# EAGLE design CENTRALE02c3 (EAGLE 9.1.2)
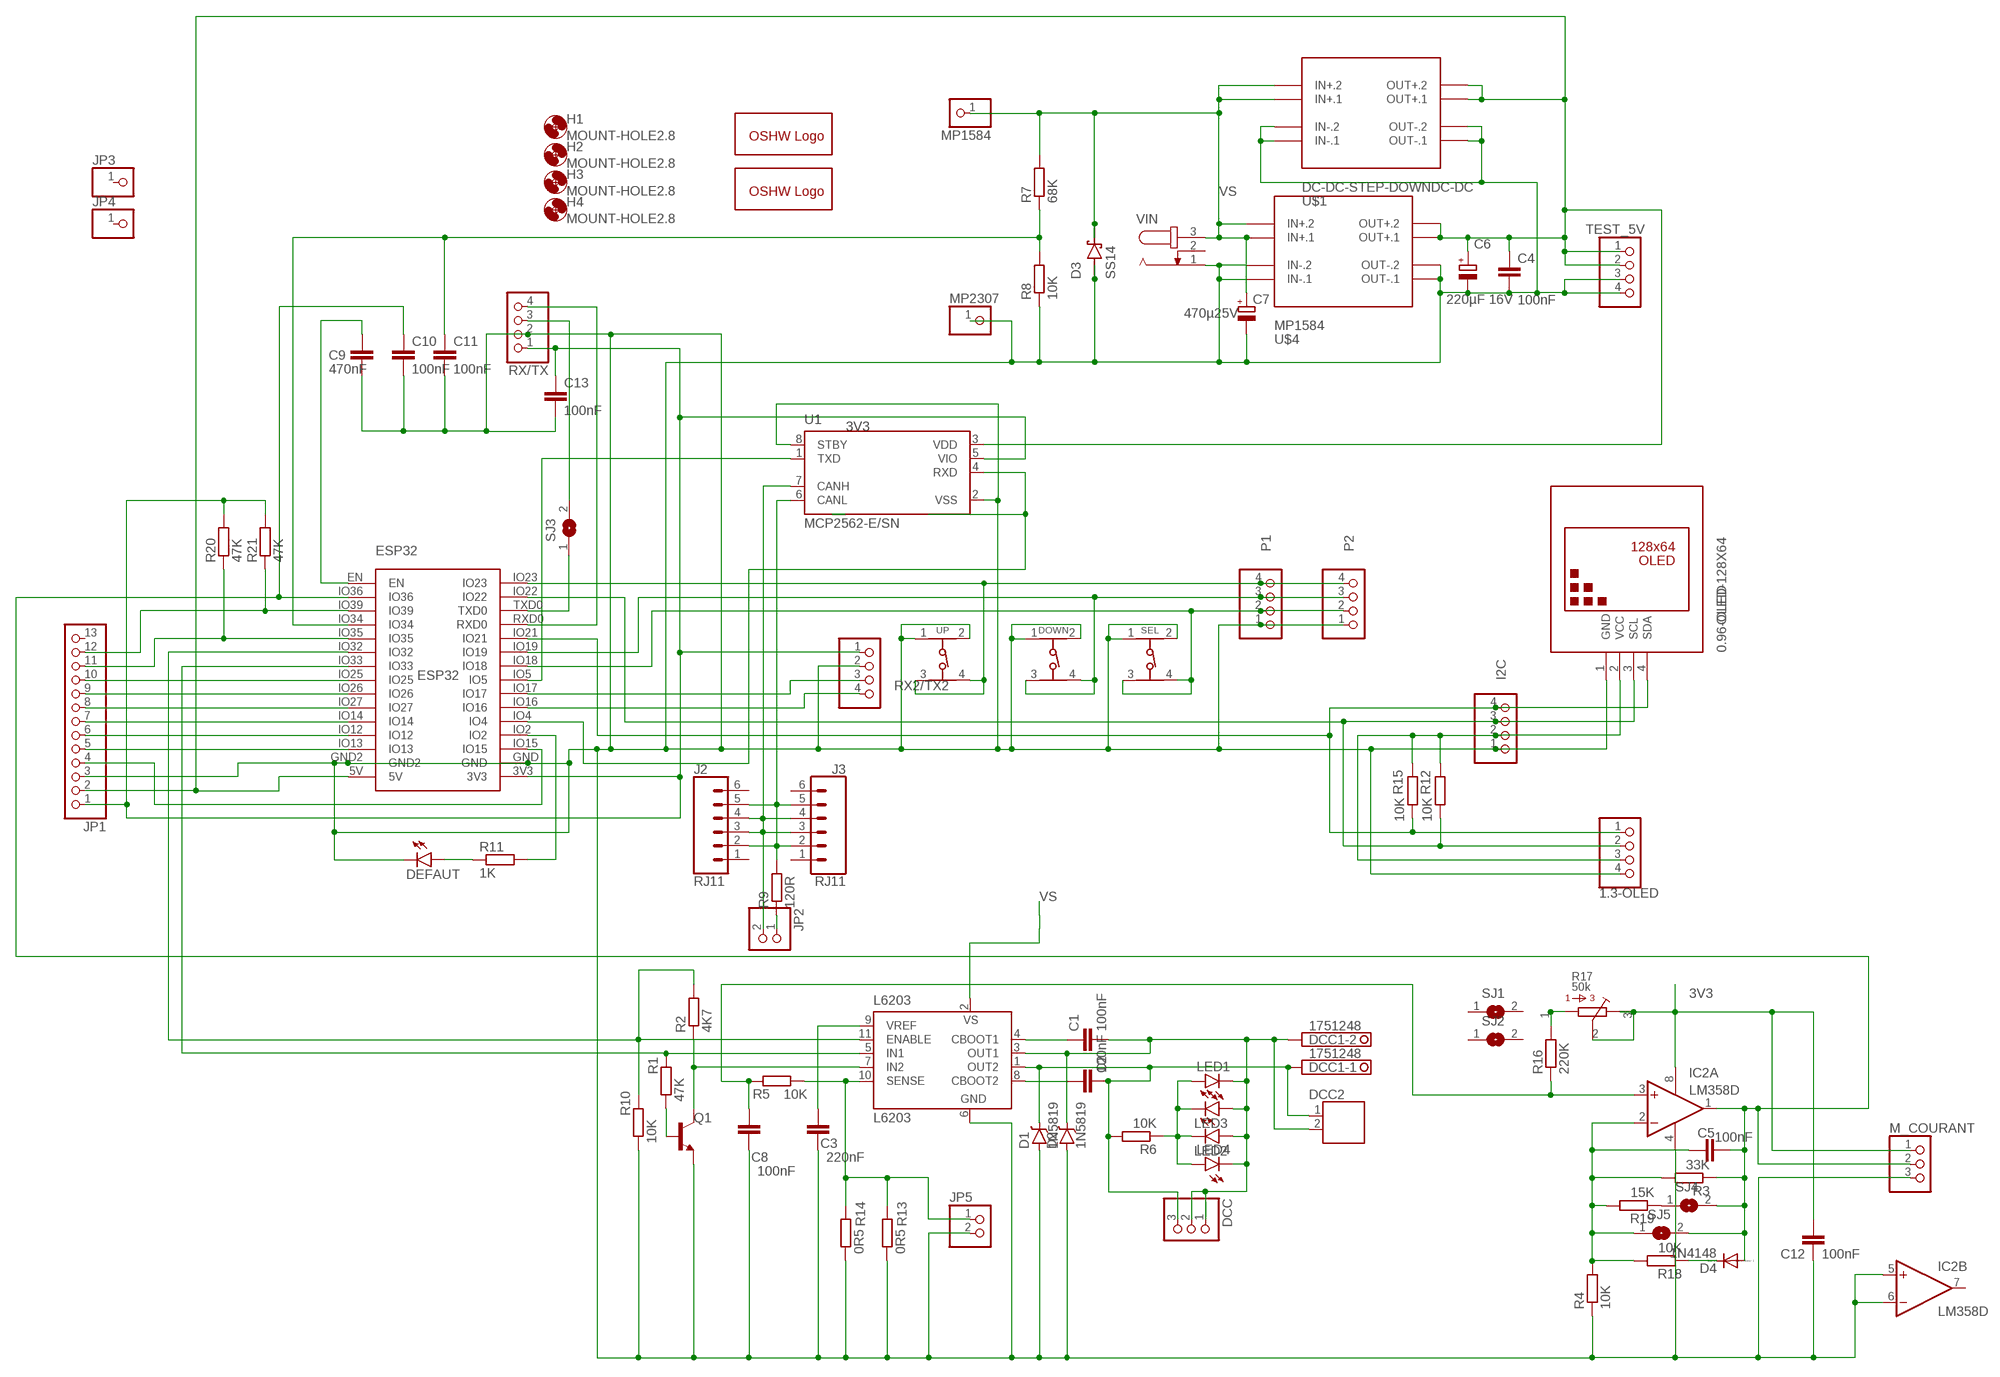
[diagram p0: schematic, sheet 1]

## Parts
0.96-OLED  OLED-128X64  DISPLAY-OLED-128X64-I2C  [DISPLAY-OLED-128X64-I2C]
1.3-OLED  PINHD-1X4  [1X04]
C1  100nF  C-EUC1206  [C1206]
C2  100nF  C-EUC1206  [C1206]
C3  220nF  C-EUC1206  [C1206]
C4  100nF  C-EUC1206  [C1206]
C5  100nF  C-EUC1206  [C1206]
C6  220µF 16V  CPOL-EUE2.5-7  [E2,5-7]
C7  470µ25V  CPOL-EUE5-10.5  [E5-10,5]
C8  100nF  C-EUC1206  [C1206]
C9  470nF  C-EUC1206  [C1206]
C10  100nF  C-EUC1206  [C1206]
C11  100nF  C-EUC1206  [C1206]
C12  100nF  C-EUC1206  [C1206]
C13  100nF  C-EUC1206  [C1206]
D1  1N5819  MBRA140  [SMA-DIODE]
D2  1N5819  MBRA140  [SMA-DIODE]
D3  SS14  [DIOM4325X250N]
D4  1N4148  1N4148DO35-7  [DO35-7]
DCC  PINHD-1X3  [1X03]
DCC1  1751248  [1751248]
DCC2  691502710002  [691502710002]
DEFAUT  LEDSMT1206  [1206]
DOWN  430456073736  [4304X60737X6]
ESP32  ESP32  [ESP32]
GOLD_ORB_SM1  OSHWLOGOLOGO5MM  [OSHW_5MM]
GOLD_ORB_SM2  OSHWLOGOLOGO5MM  [OSHW_5MM]
H1  MOUNT-HOLE2.8  [2,8]
H2  MOUNT-HOLE2.8  [2,8]
H3  MOUNT-HOLE2.8  [2,8]
H4  MOUNT-HOLE2.8  [2,8]
I2C  PINHD-1X4  [1X04]
IC2  LM358D  [SO08]
J2  RJ11  RJ11-6  [RJ11-6]
J3  RJ11  RJ11-6  [RJ11-6]
JP1  PINHD-1X13  [1X13]
JP2  PINHD-1X2  [1X02]
JP3  PINHD-1X1  [1X01]
JP4  PINHD-1X1  [1X01]
JP5  PINHD-1X2  [1X02]
L6203  L6203  [MULTIWATT-11]
LED1  LEDSMT1206  [1206]
LED2  LED3MM  [LED3MM]
LED3  LEDSMT1206  [1206]
LED4  LED3MM  [LED3MM]
M_COURANT  PINHD-1X3  [1X03]
MP1584  PINHD-1X1  [1X01]
MP2307  PINHD-1X1  [1X01]
P1  PINHD-1X4  [1X04]
P2  PINHD-1X4  [1X04]
Q1  MMBT3904LT1-NPN-SOT23-BEC  [SOT23-BEC]
R1  47K  R-EU_R0805  [R0805]
R2  4K7  R-EU_R0805  [R0805]
R3  33K  R-EU_R0805  [R0805]
R4  10K  R-EU_R0805  [R0805]
R5  10K  R-EU_R0805  [R0805]
R6  10K  R-EU_R0805  [R0805]
R7  68K  R-EU_R0805  [R0805]
R8  10K  R-EU_R0805  [R0805]
R9  120R  R-EU_M1206  [M1206]
R10  10K  R-EU_R0805  [R0805]
R11  1K  R-EU_R0805  [R0805]
R12  10K  R-EU_R0805  [R0805]
R13  0R5  R-EU_R2512  [R2512]
R14  0R5  R-EU_R2512  [R2512]
R15  10K  R-EU_R0805  [R0805]
R16  220K  R-EU_R0805  [R0805]
R17  50k  3386  [3386-MULTI]
R18  10K  R-EU_R0805  [R0805]
R19  15K  R-EU_R0805  [R0805]
R20  47K  R-EU_R0805  [R0805]
R21  47K  R-EU_R0805  [R0805]
RX2/TX2  PINHD-1X4  [1X04]
RX/TX  PINHD-1X4  [1X04]
SEL  430456073736  [4304X60737X6]
SJ1  SJ  [SJ]
SJ2  SJ  [SJ]
SJ3  SJ  [SJ]
SJ4  SJ  [SJ]
SJ5  SJ  [SJ]
TEST_5V  PINHD-1X4  [1X04]
U1  MCP2562-E/SN  [SOIC127P600X175-8N]
U$1  DC-DC-STEP-DOWNDC-DC  [DC-DC-STEP-DOWN]
U$4  MP1584  DC-DC-STEP-DOWN-MP1584  [DC-DC-STEP-DOWN-MP1584]
UP  430456073736  [4304X60737X6]
VIN  JACK-PLUG0  [SPC4077]

## Nets
3V3: 0.96-OLED.2(VCC) 1.3-OLED.3 C12.2 C13.2 ESP32.3V3 I2C.2 IC2.8(P:V+) JP1.1 M_COURANT.1 R12.1 R15.1 R17.2 R17.3 R17.6 R20.2 R21.2 RX2/TX2.1 RX/TX.1 U1.5(VIO)
GND [GND]: 0.96-OLED.1(GND) 1.3-OLED.4 C3.1 C4.2 C6.- C7.- C8.1 C9.2 C10.1 C11.1 C12.1 C13.1 D1.A D2.A D3.A DEFAUT.C DOWN.1 DOWN.2 ESP32.GND ESP32.GND2 I2C.1 IC2.4(P:V-) IC2.5(B:+IN) IC2.6(B:-IN) JP1.3 JP5.2 L6203.6(GND) M_COURANT.3 MP2307.1 P1.1 P2.1 Q1.E R4.1 R8.1 R10.1 R13.1 R14.1 RX2/TX2.2 RX/TX.2 SEL.1 SEL.2 TEST_5V.3 TEST_5V.4 U1.2(VSS) U1.8(STBY) U$1.IN-.1 U$1.IN-.2 U$1.OUT-.1 U$1.OUT-.2 U$4.IN-.1 U$4.IN-.2 U$4.OUT-.1 U$4.OUT-.2 UP.1 UP.2 VIN.1
N$1: L6203.7(IN2) Q1.C R2.1
N$2: C1.1 L6203.4(CBOOT1)
N$3: C2.1 L6203.8(CBOOT2)
N$4: ESP32.IO15 JP1.4
N$5 [PWR]: C2.2 D1.C DCC1.1 DCC2.1 DCC.3 L6203.1(OUT2) R6.2
N$6 [PWR]: C1.2 D2.C DCC1.2 DCC2.2 DCC.1 DCC.2 L6203.3(OUT1) LED1.C LED2.A LED3.A LED4.K(C)
N$7: Q1.B R1.1
N$8: C5.1 IC2.2(A:-IN) R3.2 R4.2 R18.2 R19.2 SJ5.1
N$9: C3.2 L6203.9(VREF)
N$10: C5.2 C10.2 D4.A ESP32.IO36 IC2.1(A:OUT) M_COURANT.2 R3.1 SJ4.2 SJ5.2
N$11 [PWR]: JP5.1 L6203.10(SENSE) R5.1 R13.2 R14.2
N$12: RX/TX.3 SJ3.2
N$13: C11.2 ESP32.IO34 R7.1 R8.2
N$14: C4.1 C6.+ ESP32.5V JP1.2 TEST_5V.1 TEST_5V.2 U1.3(VDD) U$1.OUT+.1 U$1.OUT+.2 U$4.OUT+.1 U$4.OUT+.2
N$15: C8.2 IC2.3(A:+IN) R5.2 R16.1
N$16: J2.3 J2.4 J3.3 J3.4 JP2.2 U1.7(CANH)
N$17: ESP32.IO5 U1.1(TXD)
N$18: ESP32.IO32 L6203.11(ENABLE) R2.2 R10.2
N$19: DEFAUT.A R11.1
N$20: ESP32.IO13 JP1.5
N$21: ESP32.IO4 U1.4(RXD)
N$22: JP2.1 R9.1
N$23: ESP32.IO12 JP1.6
N$24: ESP32.IO23 P1.4 P2.4 UP.3 UP.4
N$25: ESP32.IO14 JP1.7
N$26: ESP32.IO27 JP1.8
N$27: ESP32.IO18 P1.2 P2.2 SEL.3 SEL.4
N$28: ESP32.IO26 JP1.9
N$29: ESP32.IO35 JP1.11 R20.1
N$30: ESP32.IO39 JP1.12 R21.1
N$31: 0.96-OLED.4(SDA) 1.3-OLED.1 ESP32.IO21 I2C.4 R15.2
N$32: ESP32.IO25 JP1.10
N$33: 0.96-OLED.3(SCL) 1.3-OLED.2 ESP32.IO22 I2C.3 R12.2
N$34: ESP32.IO33 L6203.5(IN1) R1.2
N$35: R16.2 R17.1 R17.4
N$36: ESP32.IO17 RX2/TX2.3
N$37: D4.C R18.1
N$38: LED1.A LED2.K(C) LED3.C LED4.A R6.1
N$39: R19.1 SJ4.1
N$41: DOWN.3 DOWN.4 ESP32.IO19 P1.3 P2.3
N$42: J2.2 J2.5 J3.2 J3.5 R9.2 U1.6(CANL)
N$45: ESP32.RXD0 RX/TX.4
N$46: ESP32.TXD0 SJ3.1
N$48: ESP32.IO2 R11.2
N$49: C9.1 ESP32.EN
N$52: ESP32.IO16 RX2/TX2.4
VS [VS]: C7.+ D3.C(K) L6203.2(VS) MP1584.1 R7.2 U$1.IN+.1 U$1.IN+.2 U$4.IN+.1 U$4.IN+.2 VIN.3
Unconnected: IC2.7(B:OUT) J2.1 J2.6 J3.1 J3.6 JP1.13 JP3.1 JP4.1 R17.5 SJ1.1 SJ1.2 SJ2.1 SJ2.2 VIN.2

## Library data of the parts
0.96-OLED = nano3:DISPLAY-OLED-128X64-I2C: 128x64 Dot Matrix OLED Module based on SSD1306 chip Variant with I2C interface More details available here: http://www.instructables.com/id/Monochrome-096-i2c-OLED-display-with-arduino-SSD13/ SSD1306 datasheet: https://cdn-shop.adafruit.com/datasheets/SSD1306.pdf Click here to find device on ebay.com <http://www.ebay.com/sch/oled+display+128x64+iic> Note: There are two variants: I2C and SPI. Search for the proper version.
1.3-OLED I2C P1 P2 RX2/TX2 RX/TX TEST_5V = pinhead:PINHD-1X4: PIN HEADER
C1-C5 C8-C13 = rcl:C-EU: CAPACITOR, European symbol; SPICEPREFIX: C
C6 C7 = rcl:CPOL-EU: POLARIZED CAPACITOR, European symbol; SPICEPREFIX: C
D1 D2 = MBRA140:MBRA140: 40V, 1A Schottky rectifier SMA/DO-214AC package DIO-08053 Check prices <https://pricing.snapeda.com/parts/MBRA140/ON%20Semiconductor/view-part?ref=eda>; AVAILABILITY: In Stock; DESCRIPTION: Schottky Diodes & Rectifiers REC SMA 1A 40V SHTKY TR; MF: ON Semiconductor; MP: MBRA140; PACKAGE: DO-214 ON Semiconductor; PRICE: None; PURCHASE-URL: https://pricing.snapeda.com/search/part/MBRA140/?ref=eda
D3 = SS14:SS14: Check availability <https://pricing.snapeda.com/parts/SS14/Taiwan%20Semiconductor/view-part?ref=eda>; AVAILABILITY: In Stock; CHECK_PRICES: https://www.snapeda.com/parts/SS14/Taiwan+Semiconductor/view-part/?ref=eda; DESCRIPTION: 1A, 40V, Schottky Rectifier; MF: Taiwan Semiconductor; MP: SS14; PACKAGE: SMA-2 Taiwan Semiconductor; PRICE: None; SNAPEDA_LINK: https://www.snapeda.com/parts/SS14/Taiwan+Semiconductor/view-part/?ref=snap
D4 = diode:1N4148: DIODE high speed (Philips)
DCC M_COURANT = pinhead:PINHD-1X3: PIN HEADER
DCC1 = con-phoenix-350:1751248: MKDS 1/ 2-3,5 Printklemme Nennstrom: 10 A Bemessungsspannung: 160 V Raster: 3,5 mm Polzahl: 2 Montageart: Löten Anschlussart: Schraubanschluss Anschlussrichtung vom Leiter zur Platine: 0° Source: http://eshop.phoenixcontact.com .. 1751248.pdf; OC_FARNELL: unknown; OC_NEWARK: unknown
DCC2 = Wurth_Elektronik_Electromechanic_Terminal_Blocks_Connectors_rev16b:691502710002: WR-TBL Terminal block - serie 5027 - 2 Pins;=>Code : Con_TBL_Screw_PressureClamp_6915027100xx_691502710002 <http://katalog.we-online.de/media/images/eican/Con_TBL_Screw_PressureClamp_6915027100xx_pf2.jpg> Details see: http://katalog.we-online.de/em/datasheet/6915027100xx.pdf Created 11/27/2014, Karrer Zheng 2014 (C) Wurth Elektronik
DEFAUT LED1-LED4 = led:LED: LED OSRAM: - CHIPLED LG R971, LG N971, LY N971, LG Q971, LY Q971, LO R971, LY R971 LH N974, LH R974 LS Q976, LO Q976, LY Q976 LO Q996 - Hyper CHIPLED LW Q18S LB Q993, LB Q99A, LB R99A - SideLED LS A670, LO A670, LY A670, LG A670, LP A670 LB A673, LV A673, LT A673, LW A673 LH A674 LY A675 LS A676, LA A676, LO A676, LY A676, LW A676 LS A679, LY A679, LG A679 - Hyper Micro SIDELED® LS Y876, LA Y876, LO Y876, LY Y876 LT Y87S - SmartLED LW L88C, LW L88S LB L89C, LB L89S, LG L890 LS L89K, LO L89K, LY L89K LS L896, LA L896, LO L896, LY L896 - TOPLED LS T670, LO T670, LY T670, LG T670, LP T670 LSG T670, LSP T670, LSY T670, LOP T670, LYG T670 LG T671, LOG T671, LSG T671 LB T673, LV T673, LT T673, LW T673 LH T674 LS T676, LA T676, LO T676, LY T676, LB T676, LH T676, LSB T676, LW T676 LB T67C, LV T67C, LT T67C, LS T67K, LO T67K, LY T67K, LW E67C LS E67B, LA E67B, LO E67B, LY E67B, LB E67C, LV E67C, LT E67C LW T67C LS T679, LY T679, LG T679 LS T770, LO T770, LY T770, LG T770, LP T770 LB T773, LV T773, LT T773, LW T773 LH T774 LS E675, LA E675, LY E675, LS T675 LS T776, LA T776, LO T776, LY T776, LB T776 LHGB T686 LT T68C, LB T68C - Hyper Mini TOPLED® LB M676 - Mini TOPLED Santana® LG M470 LS M47K, LO M47K, LY M47K Source: http://www.osram.convergy.de LUXEON: - LUMILED® LXK2-PW12-R00, LXK2-PW12-S00, LXK2-PW14-U00, LXK2-PW14-V00 LXK2-PM12-R00, LXK2-PM12-S00, LXK2-PM14-U00 LXK2-PE12-Q00, LXK2-PE12-R00, LXK2-PE12-S00, LXK2-PE14-T00, LXK2-PE14-U00 LXK2-PB12-K00, LXK2-PB12-L00, LXK2-PB12-M00, LXK2-PB14-N00, LXK2-PB14-P00, LXK2-PB14-Q00 LXK2-PR12-L00, LXK2-PR12-M00, LXK2-PR14-Q00, LXK2-PR14-R00 LXK2-PD12-Q00, LXK2-PD12-R00, LXK2-PD12-S00 LXK2-PH12-R00, LXK2-PH12-S00 LXK2-PL12-P00, LXK2-PL12-Q00, LXK2-PL12-R00 Source: www.luxeon.com KINGBRIGHT: KA-3528ASYC Source: www.kingbright.com
DOWN SEL UP = o163724v244 Eagle_WS-TATV (rev20a):430456073736: WS-TATV THT Washable Tact Switch 12x12 mm Material Properties Cover Material : Stainless Steel Properties Actuator Material:LCP Actuator Flammability Rating:UL94 V-0 Actuator Color:Black; Salmon; White Frame Material:PPA Frame Flammability Rating:UL94 HB Frame Color:Black Contact Material:Stainless Steel Contact Plating:Silver Terminal Material:Copper Alloy Terminal Plating:Silver VR:12 V (DC) Contact Resistance Initial:100 mΩ Contact Resistance After Life Test:2 Ω RISO:100 MΩ Withstanding Voltage:250 V (AC) Washable:Yes Qty.:50 Mechanical Properties Electrical Life:200000 Times; 300000 Times; 500000 Times Stroke :0.3 mm General Information Operating Temperature:-40 up to +85 °C Washable:Yes <https://www.we-online.com/catalog/media/o61120v209%20Family_WS_TSW_THT_4304x60xx7x6_pf2.jpg> Details see: https://www.we-online.com/catalog/en/TATV_12X12_THT_WASHABLE_4304x60xx7x6/ Updated by yingchun,Shan;2020-02-21 2020(C) Würth Elektronik; DATASHEET-URL: https://www.we-online.com/catalog/datasheet/430456073736.pdf; H: 7.3mm; OPERATION-FORCE: 360g; PART-NUMBER: 430456073736; QTY: 50
ESP32 = ESP32-DEVKIT_M2:ESP32: Quadruple half-H driver; AVAILABILITY: Unavailable; DESCRIPTION: Half Bridge _4_ Driver DC Motors, General Purpose, Solenoids, Stepper Motors Bipolar 16-PDIP; MF: Texas Instruments; MP: SN754410; PACKAGE: PDIP-16 Texas Instruments; PRICE: None
GOLD_ORB_SM1 GOLD_ORB_SM2 = oshw:OSHWLOGO: The OSHW logo for PCB layout
H1-H4 = holes:MOUNT-HOLE: MOUNTING HOLE with drill center marker
IC2 = linear:LM358: OP AMP also LM158; LM258; LM2904 Source: http://cache.national.com/ds/LM/LM158.pdf
J2 J3 = SparkFun-Connectors:RJ11-6: RJ11 Jack - 6 pin Commonly found on CAT3 devices and some Microchip programmers. Here is the connector we sell at SparkFun: RJ11 6-Pin Connector <https://www.sparkfun.com/products/132> (PRT-00132) Datasheet <http://www.sparkfun.com/datasheets/Prototyping/Connectors/RJ11-Datasheet.pdf> It is used on this SparkFun product: SparkFun Weather Shield <https://www.sparkfun.com/products/12081> (DEV-12081) Weather Meters <https://www.sparkfun.com/products/8942> (SEN-08942); PROD_ID: CONN-08590; SF_ID: PRT-00132
JP1 = pinhead:PINHD-1X13: PIN HEADER
JP2 JP5 = pinhead:PINHD-1X2: PIN HEADER
JP3 JP4 = adafruit:PINHD-1X1: Pin header 1x1 for 0.1" spacing With round pins
L6203 = st-microelectronics:L6203: DMOS FULL BRIDGE DRIVER; MPN: L6203; OC_FARNELL: 1467715; OC_NEWARK: 56P8434
MP1584 MP2307 = pinhead:PINHD-1X1: PIN HEADER
Q1 = transistor:*-NPN-: NPN Transistror BF959 corrected 2008.03.06
R1-R8 R10-R16 R18-R21 = rcl:R-EU_: RESISTOR, European symbol; SPICEPREFIX: R
R9 = resistor:R-EU_: RESISTOR, European symbol
R17 = 3386M3:3386: 3386 Series 3/8" Square Trimmer (Multi-Package F,P,K & Y)
SJ1-SJ5 = jumper:SJ: SMD solder JUMPER
U1 = MCP2562-E_SN:MCP2562-E/SN: MCP2562 Series 5 V Surface Mount High-Speed CAN Transceiver - SOIC-8 Check availability <https://pricing.snapeda.com/parts/MCP2562-E/SN/Microchip/view-part?ref=eda>; AVAILABILITY: In Stock; CHECK_PRICES: https://www.snapeda.com/parts/MCP2562-E/SN/Microchip/view-part/?ref=eda; DESCRIPTION: Microchip MCP2562-E/SN,CAN Transceiver 1MBps 1-channel IEC 61000-4-2,8-Pin SOIC | Microchip Technology Inc. MCP2562-E/SN; MF: Microchip; MP: MCP2562-E/SN; PACKAGE: SO-8 Microchip; PRICE: None; PURCHASE-URL: https://www.snapeda.com/api/url_track_click_mouser/?unipart_id=234490&manufacturer=Microchip&part_name=MCP2562-E/SN&search_term=None; SNAPEDA_LINK: https://www.snapeda.com/parts/MCP2562-E/SN/Microchip/view-part/?ref=snap
U$1 = dc-dc:DC-DC-STEP-DOWN: DC/DC Step-Down Regulator
U$4 = diy-modules:DC-DC-STEP-DOWN-MP1584: DC/DC Step-Down Regulator based on MP1584 chip MP1584 datasheet available here: http://www.haoyuelectronics.com/Attachment/MP1584/MP1584.pdf Click here to find device on ebay.com <http://www.ebay.com/sch/mp1584+module>
VIN = con-jack:JACK-PLUG: DC POWER JACK Power Jack, DC, Right Angle, Through Hole, Rated 5A at 16VDC, PC Terminals Distributor: Farnell (www.Farnell.de) Drawing: 84N1161.pdf / 84N1162.pdf Manufacturer: SPC Technology (www.spctechnology.com) Type: SPC4077 / SPC 4078

## Net classes
0 default: width 0.305 mm
1 PWR: width 1.372 mm
2 VS: width 1.372 mm
3 GND: width 0.914 mm

## Board
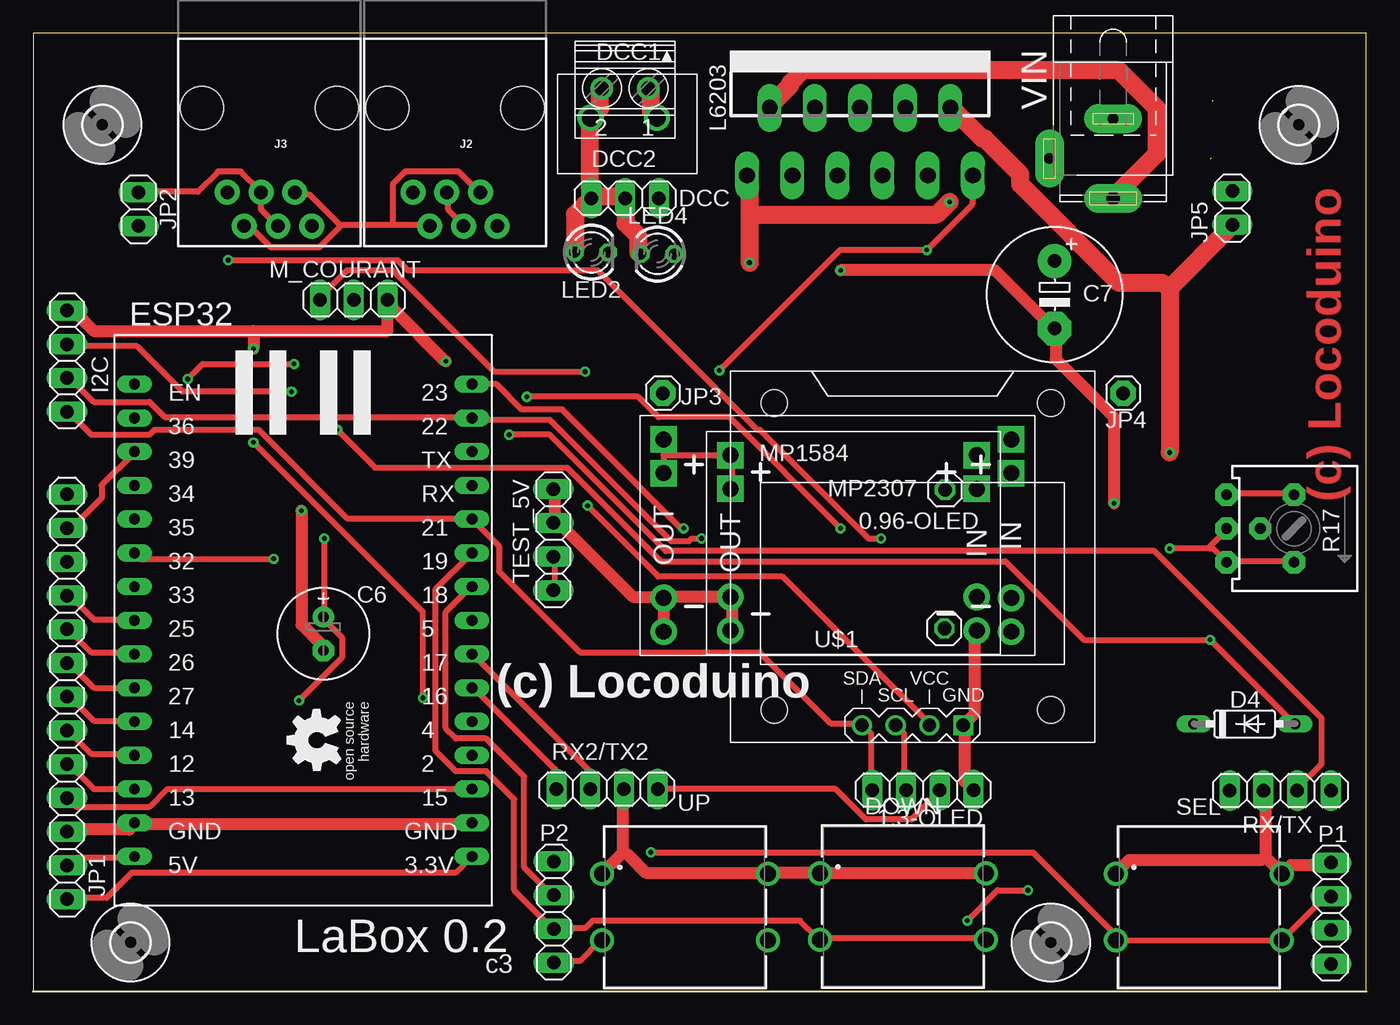
[diagram p1: board, top side]
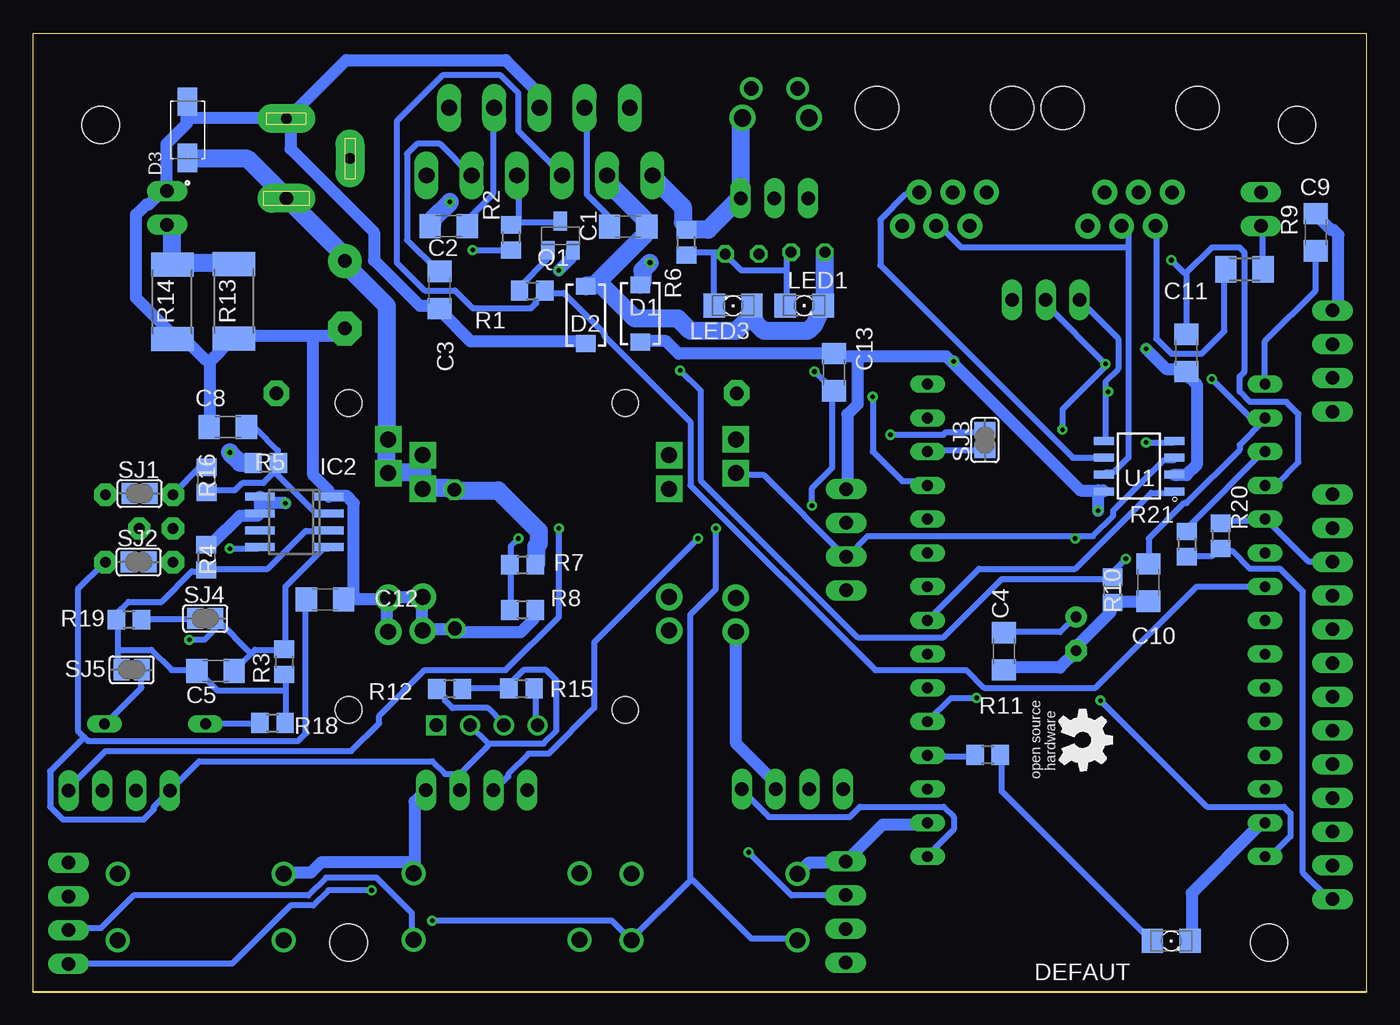
[diagram p2: board, bottom side, seen from below]

Size 100.33 x 72.14 mm. Coordinates in mm from the lower left corner, seen from the top.
Outline: 100.33,0 100.33,72.14 0,72.12 0,0 100.33,0
Copper layers (1*16): Top 0.035mm / dielectric 1.5mm / Bottom 0.035mm
Design rules "default *": minimum track width 18mil, minimum drill 0.35mm, track to track 12mil, track to pad 12mil, pad to pad 12mil, via to via 12mil, smd to smd 12mil, copper to edge 40mil, drill to drill 12mil, minimum pad ring 10mil, minimum via ring 8mil, stop-mask expansion 4mil, vias tented up to drill 0mil, thermal gap 10mil

### Footprints (pad centres in the part's own frame; a part is rotated, then mirrored left to right if it is on the bottom)
DISPLAY-OLED-128X64-I2C = drill 1 square: 1 -3.81,12.7 | drill 1: 2 -1.27,12.7; 3 1.27,12.7; 4 3.81,12.7 | hole 2: -10.414,11.557; 10.414,11.557; 10.414,-11.557; -10.414,-11.557
1X04 = drill 1.016 long: 1 -3.81,0; 2 -1.27,0; 3 1.27,0; 4 3.81,0
C1206 = smd 1.6 x 1.8: 1 -1.4,0; 2 1.4,0
E2,5-7 = drill 0.813 pad 1.6: + -1.27,0 | drill 0.813 pad 1.6 octagon: - 1.27,0
E5-10,5 = drill 1.016 pad 2.54: + -2.54,0 | drill 1.016 pad 2.54 octagon: - 2.54,0
SMA-DIODE = smd 1.27 x 1.47: A -2.15,0; C 2.15,0
DIOM4325X250N = smd 2.12 x 1.5: A 2.115,0; C -2.115,0
DO35-7 = drill 0.813 long: A 3.81,0; C -3.81,0
1X03 = drill 1.016 long: 1 -2.54,0; 2 0,0; 3 2.54,0
1751248 = drill 1.1 pad 1.7: 1 -1.75,-0.1; 2 1.75,-0.1
691502710002 = drill 1.3: 1 -2.5,0; 2 2.5,0
1206 = smd 1.6 x 1.803: A -1.422,0; C 1.422,0
4304X60737X6 = drill 1.2: 1 -6.25,2.5; 2 6.25,2.5; 3 -6.25,-2.5; 4 6.25,-2.5
ESP32 = drill 0.813 long: 3V3 29.21,10.16; 5V 3.81,10.16; EN 3.81,45.72; GND 29.21,12.7; GND2 3.81,12.7; IO2 29.21,17.78; IO4 29.21,20.32; IO5 29.21,27.94; IO12 3.81,17.78; IO13 3.81,15.24; IO14 3.81,20.32; IO15 29.21,15.24; IO16 29.21,22.86; IO17 29.21,25.4; IO18 29.21,30.48; IO19 29.21,33.02; IO21 29.21,35.56; IO22 29.21,43.18; IO23 29.21,45.72; IO25 3.81,27.94; IO26 3.81,25.4; IO27 3.81,22.86; IO32 3.81,33.02; IO33 3.81,30.48; IO34 3.81,38.1; IO35 3.81,35.56; IO36 3.81,43.18; IO39 3.81,40.64; RXD0 29.21,38.1; TXD0 29.21,40.64
2,8 = hole 2.8: 0,0
SO08 = smd 0.6 x 2.2: 1 -1.905,-2.6; 2 -0.635,-2.6; 3 0.635,-2.6; 4 1.905,-2.6; 5 1.905,2.6; 6 0.635,2.6; 7 -0.635,2.6; 8 -1.905,2.6
RJ11-6 = drill 1.016 pad 1.88: 1 -3.175,8.89; 2 -1.905,6.35; 3 -0.635,8.89; 4 0.635,6.35; 5 1.905,8.89; 6 3.175,6.35 | hole 3.251: -5.08,0; 5.08,0
1X13 = drill 1.016 long: 1 -15.24,0; 2 -12.7,0; 3 -10.16,0; 4 -7.62,0; 5 -5.08,0; 6 -2.54,0; 7 0,0; 8 2.54,0; 9 5.08,0; 10 7.62,0; 11 10.16,0; 12 12.7,0; 13 15.24,0
1X02 = drill 1.016 long: 1 -1.27,0; 2 1.27,0
1X01 = drill 1.016 pad 1.93 octagon: 1 0,0
MULTIWATT-11 = drill 1.2 long: 1 -8.5,-6.35; 2 -6.8,-1.27; 3 -5.1,-6.35; 4 -3.4,-1.27; 5 -1.7,-6.35; 6 0,-1.27; 7 1.7,-6.35; 8 3.4,-1.27; 9 5.1,-6.35; 10 6.8,-1.27; 11 8.5,-6.35
LED3MM = drill 0.813 octagon: A -1.27,0; K 1.27,0
1X01' = drill 1.016 octagon: 1 0,0
SOT23-BEC = smd 1 x 1.4: B -0.95,-1.1; C 0,1.1; E 0.95,-1.1
R0805 = smd 1.3 x 1.5: 1 -0.95,0; 2 0.95,0
M1206 = smd 1.6 x 2: 1 -1.4,0; 2 1.4,0
R2512 = smd 1.8 x 3.2: 1 -2.8,0; 2 2.8,0
3386-MULTI = drill 0.813 pad 1.676 octagon: 1 -2.54,-5.08; 2 0,-5.08; 3 2.54,-5.08; 4 -2.54,0; 5 0,-2.54; 6 2.54,0
SJ = smd 1.168 x 1.6: 1 -0.762,0; 2 0.762,0
SOIC127P600X175-8N = smd 1.5 x 0.6: 1 -2.65,1.905; 2 -2.65,0.635; 3 -2.65,-0.635; 4 -2.65,-1.905; 5 2.65,-1.905; 6 2.65,-0.635; 7 2.65,0.635; 8 2.65,1.905
DC-DC-STEP-DOWN = drill 1.2 pad 2 square: IN+.1 -13.081,-4.699; IN+.2 -13.081,-7.239; OUT+.1 13.081,-4.699; OUT+.2 13.081,-7.239 | drill 1.2 pad 2: IN-.1 -13.081,7.239; IN-.2 -13.081,4.699; OUT-.1 13.081,7.239; OUT-.2 13.081,4.699
DC-DC-STEP-DOWN-MP1584 = drill 1.2 pad 2 square: IN+.1 -9.271,-4.064; IN+.2 -9.271,-6.604; OUT+.1 9.271,-4.064; OUT+.2 9.271,-6.604 | drill 1.2 pad 2: IN-.1 -9.271,6.604; IN-.2 -9.271,4.064; OUT-.1 9.271,6.604; OUT-.2 9.271,4.064
SPC4077 = drill 0.8 pad 2.184 long: 1 -3,0; 2 0,-4.8 | drill 1 pad 2.184 long: 3 3,0

### Placement (x,y rotation side)
0.96-OLED  66.18,32.74 180 top
1.3-OLED  66.97,15.16 0 top
C1  55.55,57.57 0 bottom
C2  69.06,57.62 180 bottom
C3  69.73,52.8 90 bottom
C4  27.27,25.61 270 bottom
C5  86.6,24.14 0 bottom
C6  21.83,26.93 270 top
C7  76.88,52.45 270 top
C8  85.68,42.49 0 bottom
C9  3.81,57.15 90 bottom
C10  16.41,30.79 90 bottom
C11  13.54,48.07 90 bottom
C12  78.36,29.51 180 bottom
C13  40.05,46.62 270 bottom
D1  54.64,51.04 90 bottom
D2  58.73,50.93 90 bottom
D3  88.72,64.87 90 bottom
D4  91.16,20.16 0 top
DCC  44.55,59.71 0 top
DCC1  44.55,67.89 180 top
DCC2  44.45,65.76 180 top
DEFAUT  14.68,3.81 0 bottom
DOWN  65.47,6.39 0 top
ESP32  3.81,0 0 top
GOLD_ORB_SM1  21.35,18.93 90 top
GOLD_ORB_SM2  21.35,18.94 270 bottom
H1  76.59,3.69 0 top
H2  95.25,65.24 0 top
H3  5.2,65.24 0 top
H4  7.33,3.7 0 top
I2C  2.54,47.46 270 top
IC2  80.68,35.35 90 bottom
J2  31.75,66.51 180 top
J3  17.78,66.51 180 top
JP1  2.54,22.19 90 top
JP2  7.94,58.89 90 top
JP3  47.38,45.05 0 top
JP4  82.04,45.04 0 top
JP5  90.25,58.99 90 top
L6203  62.23,67.78 0 top
LED1  42.3,51.63 0 bottom
LED2  42.02,55.65 0 top
LED3  47.65,51.62 180 bottom
LED4  46.98,55.52 180 top
M_COURANT  24.13,52.07 0 top
MP1584  [1X01']  68.63,37.78 180 top
MP2307  [1X01']  68.58,27.33 180 top
P1  97.67,5.89 270 top
P2  39.18,5.98 270 top
Q1  60.65,56.89 0 bottom
R1  62.78,52.75 0 bottom
R2  64.36,56.76 270 bottom
R3  81.44,24.82 270 bottom
R4  87.3,32.68 270 bottom
R5  82.83,39.77 0 bottom
R6  51.17,56.39 90 bottom
R7  63.5,32.13 0 bottom
R8  63.5,28.74 180 bottom
R9  9.16,54.37 180 bottom
R10  19.09,30.23 90 bottom
R11  28.5,17.81 180 bottom
R12  68.99,22.78 180 bottom
R13  85.22,51.96 90 bottom
R14  89.86,51.9 90 bottom
R15  63.59,22.81 0 bottom
R16  87.28,38.51 90 bottom
R17  94.9,34.85 270 top
R18  82.31,20.22 0 bottom
R19  93.12,27.99 180 bottom
R20  10.97,34.29 270 bottom
R21  13.51,33.67 270 bottom
RX2/TX2  43.18,15.24 180 top
RX/TX  93.86,15.12 0 top
SEL  87.74,6.35 0 top
SJ1  92.32,37.49 0 bottom
SJ2  92.39,32.33 0 bottom
SJ3  28.7,41.51 90 bottom
SJ4  87.38,28.08 0 bottom
SJ5  92.92,24.23 0 bottom
TEST_5V  39.15,34.02 90 top
U1  17.11,39.55 180 bottom
U$1  60.53,34.33 180 top
U$4  61.74,33.77 180 top
UP  49.05,6.35 0 top
VIN  81.28,62.7 270 top

### Tracks (layer width: path | path; a pad name or v marks a point on that pad's centre or on a via)
3V3  (via drill 0.35)
  Top 0.457: v41.53,46.67 34.67,46.67 27.05,54.29 23.62,54.29 21.53,52.2 M_COURANT.1 | v19.43,45.15 11.24,45.15 7.81,48.58 2.67,48.58 I2C.2 | 88.58,33.34 88.77,33.34 89.72,32.38 R17.3 89.92,32.38 94.87,32.38 R17.6 | 88.58,33.34 v85.53,33.34 | R17.2 89.72,34.67 88.58,33.53 88.58,33.34 | RX2/TX2.1 60.39,15.24 62.67,12.95 66.1,12.95 68.2,15.05 1.3-OLED.3 | ESP32.3V3 31.81,8.95 7.43,8.95 5.52,7.05 2.67,7.05 JP1.1 | v41.72,36.58 47.05,31.24 56.39,31.24 67.44,20.19 0.96-OLED.2
  Bottom 0.457: 19.62,45.15 19.62,45.91 18.67,46.86 18.67,49.15 M_COURANT.1 | 19.62,45.15 19.62,41.53 U1.5 | v41.53,46.67 40.2,45.34 C13.2 40.2,45.15 40.2,39.43 41.72,37.91 v41.72,36.58 | v19.43,45.15 19.62,45.15 | R21.2 13.34,32.77 11.62,32.77 11.05,33.34 R20.2 10.86,33.15 10.1,33.15 8.76,31.81 6.48,31.81 4.76,30.1 4.76,8.95 2.67,6.86 JP1.1 | ESP32.3V3 32.96,10.29 31.05,12.19 31.05,13.14 31.81,13.91 38.1,13.91 38.86,13.14 44.96,13.14 47.05,15.24 RX2/TX2.1 | R12.1 68.01,22.86 64.58,22.86 R15.1 64.58,23.05 63.44,24.19 61.72,24.19 60.96,23.43 60.96,19.62 61.91,18.67 66.1,18.67 | 66.1,18.67 67.44,20 0.96-OLED.2 | 66.1,18.67 66.1,18.48 68.2,16.38 68.2,15.24 1.3-OLED.3 68.39,16.38 69.34,16.38 70.29,17.34 87.82,17.34 89.92,15.24 RX/TX.1 90.11,15.05 91.25,13.91 91.25,13.72 92.01,12.95 98.11,12.95 99.06,13.91 99.06,16.57 96.49,19.14 | v85.53,33.34 83.44,33.34 IC2.8 | 96.49,19.14 96.97,19.62 96.97,30.29 95.06,32.19 R17.6 | 96.49,19.14 96.2,18.86 80.39,18.86 79.82,19.43 79.82,29.34 C12.2
GND  (via drill 0.35)  (1 unrouted)
  Top 0.914: 16.57,49.72 4.57,49.72 3.05,51.24 2.67,51.24 I2C.1 | 16.57,49.72 26.67,49.72 M_COURANT.3 27.05,51.44 v31.05,47.43 | 16.57,49.72 v16.57,48.39 | U$1.OUT-.1 47.43,27.24 47.43,29.53 U$1.OUT-.2 | U$4.OUT-.1 52.58,27.24 52.58,29.53 U$4.OUT-.2 52.01,29.72 47.82,29.72 U$1.OUT-.2 | TEST_5V.4 39.24,37.72 39.24,35.43 TEST_5V.3 39.62,35.24 45.15,29.72 47.05,29.72 U$1.OUT-.2 | v20.19,36.2 20.19,27.62 21.72,26.1 21.72,25.72 C6.- | v60.77,54.29 72.39,54.29 76.77,49.91 C7.- 76.96,49.53 76.96,47.62 81.34,43.24 v81.34,36.77 | 92.77,10.1 92.77,15.05 RX/TX.2 | 92.77,10.1 93.92,8.95 SEL.2 94.3,9.14 94.68,9.53 97.54,9.53 P1.1 | 1.3-OLED.4 70.67,15.24 70.1,15.81 70.1,20 0.96-OLED.1 70.29,20.38 70.87,20.95 70.87,27.05 U$4.IN-.1 | 92.77,10.1 92.39,9.91 82.49,9.91 81.53,8.95 SEL.1 | JP1.3 2.67,12.19 7.24,12.19 7.62,12.57 ESP32.GND2 8,12.57 32.96,12.57 ESP32.GND | 44.39,10.48 44.39,15.24 RX2/TX2.2 | 44.39,10.48 42.86,8.95 UP.1 | 44.39,10.48 44.77,10.29 46.1,8.95 54.86,8.95 UP.2 55.44,8.95 59.05,8.95 DOWN.1 59.63,8.95 71.63,8.95 DOWN.2
  Bottom 0.914: U1.2 14.29,38.86 13.53,38.86 12.76,39.62 12.76,45.72 13.53,46.48 C11.1 13.91,46.86 15.05,46.86 v16.57,48.39 | C9.2 3.81,58.48 2.67,57.34 2.48,57.34 2.1,56.96 2.1,51.82 2.48,51.44 I2C.1 | C10.1 16.57,29.34 19.05,29.34 R10.1 19.24,28.96 19.24,28.57 21.72,26.1 C6.- 21.91,25.53 23.05,24.38 27.24,24.38 C4.2 | D1.A 54.48,48.96 52.69,48.96 51.75,48.02 C13.1 39.62,47.82 38.29,47.82 | 20.19,37.72 21.53,37.72 31.15,47.34 | 20.19,37.72 19.81,37.72 U1.8 | 31.15,47.34 31.62,47.82 38.29,47.82 | 38.29,47.82 38.29,44.2 39.05,43.43 39.05,37.91 TEST_5V.4 | 20.19,37.72 v20.19,36.2 | v31.05,47.43 31.15,47.34 | D2.A 58.86,48.96 67.44,48.96 69.72,51.24 C3.1 70.1,51.63 71.25,51.63 74.68,55.05 74.68,57.15 80.96,63.44 80.96,65.34 VIN.1 | 88.77,65.72 88.77,65.34 90.3,63.82 90.3,60.39 JP5.2 90.68,60.2 91.63,59.24 91.82,59.24 92.58,58.48 92.58,52.2 89.92,49.53 R14.1 89.72,48.96 88.77,48.96 87.44,47.62 87.06,47.43 | 88.77,65.72 88.77,67.06 | L6203.6 62.29,66.67 62.29,67.63 64.77,70.1 76.77,70.1 81.15,65.72 VIN.1 | 88.77,65.72 81.72,65.72 VIN.1 | 87.06,47.43 87.06,42.67 C8.1 | 87.06,47.43 85.34,49.15 R13.1 84.77,49.34 79.25,49.34 | R4.1 87.25,33.72 86.87,33.72 84.77,35.81 83.44,35.81 IC2.6 83.25,36.39 83.25,36.77 | 83.25,36.77 83.25,37.15 IC2.5 | v60.77,54.29 59.82,55.24 59.82,55.63 Q1.E | v81.34,36.77 83.25,36.77 | 79.25,49.34 77.34,49.34 76.96,49.72 C7.- | R8.1 62.67,28.57 62.67,28 63.63,27.05 68.39,27.05 68.58,27.24 MP2307.1 68.96,27.24 70.87,27.24 U$4.IN-.1 71.06,27.62 71.06,29.53 U$4.IN-.2 71.44,29.72 73.15,29.72 U$1.IN-.2 | U$1.IN-.2 73.72,29.53 76.96,29.53 C12.1 76.2,29.91 76.2,36.77 76.76,37.33 78.01,37.33 IC2.4 78.11,37.72 79.25,38.86 79.25,49.34
  Bottom 0.914: U$1.IN-.1 73.72,27.24 73.72,29.15 U$1.IN-.2 | 1.3-OLED.4 70.87,15.05 71.63,14.29 71.63,8.95 DOWN.2 72.01,9.72 78.68,9.72 79.44,8.95 81.34,8.95 SEL.1 | DEFAUT.C 13.14,3.81 13.14,7.43 8,12.57 7.62,12.57 ESP32.GND2 | ESP32.GND 33.15,12.57 36.39,12.57 39.05,9.91 P2.1 39.62,9.72 41.91,9.72 42.67,8.95 UP.1 | U$1.OUT-.1 47.43,27.05 47.43,18.67 44.58,15.81 44.58,15.24 RX2/TX2.2
N$1
  Bottom 0.457: Q1.C 60.77,57.91 64.01,57.91 64.2,57.72 R2.1 63.82,58.1 63.82,61.34 L6203.7
N$2
  Bottom 0.457: C1.1 56.96,57.72 56.96,58.29 58.67,60.01 58.67,66.48 L6203.4
N$3
  Bottom 0.457: C2.1 67.63,57.72 67.63,58.1 65.72,60.01 65.72,66.48 L6203.8
N$4
  Top 0.457: ESP32.IO15 10.1,15.24 8.76,13.91 3.24,13.91 2.67,14.48 JP1.4
N$5  (via drill 0.35)
  Top 1.372: DCC1.1 46.48,67.82 46.48,66.29 46.86,65.91 DCC2.1 | 53.91,58.48 53.91,61.34 L6203.1 | 53.91,58.48 v53.91,54.86 | v68.96,59.44 68.01,58.48 53.91,58.48
  Bottom 1.372: v53.91,54.86 54.48,54.29 54.48,53.34 D1.C | v68.96,59.44 70.29,58.1 70.29,57.72 C2.2 | L6203.1 53.72,61.34 51.44,59.05 51.44,57.91 R6.2 51.05,57.34 49.53,57.34 47.24,59.63 DCC.3 47.05,60.39 47.05,65.72 DCC2.1
N$6
  Top 1.372: DCC1.2 42.67,67.82 42.67,66.48 42.1,65.91 DCC2.2 41.91,65.15 41.91,60.39 DCC.1 | LED4.K 45.53,55.63 45.53,56.88 44.58,57.83 44.58,59.63 DCC.2 44.01,59.82 42.1,59.82 DCC.1 | LED2.A 40.77,55.82 40.77,58.48 41.53,59.24 DCC.1
  Bottom 1.372: 57.82,53.44 54.29,56.96 54.29,57.53 C1.2 54.29,58.1 56.96,60.77 56.96,61.34 L6203.3 | 57.82,53.44 58.1,53.15 58.67,53.15 D2.C | LED2.A 40.77,55.63 40.77,51.82 LED1.C 41.55,50.19 42.02,49.72 45.31,49.72 46.31,50.72 | LED3.A 46.1,51.44 46.1,50.86 46.31,50.72 | 57.82,53.44 55.05,50.67 51.81,50.67 50.86,49.72 47.43,49.72 46.67,50.48 46.31,50.72
N$7
  Bottom 0.457: Q1.B 61.72,55.63 61.72,55.05 63.63,53.15 63.63,52.77 R1.1
N$8
  Bottom 0.457: 81.34,22.67 81.34,23.81 R3.2 | 81.34,22.67 81.34,20.38 R18.2 | 93.92,25.72 93.92,24.57 93.73,24.38 SJ5.1 | 93.92,25.72 93.92,27.81 R19.2 94.11,28.19 94.11,28.38 93.15,29.34 90.68,29.34 88.39,31.62 87.44,31.62 R4.2 87.25,31.81 82.68,31.81 79.82,34.67 78.11,34.67 IC2.2 | 93.92,25.72 91.44,25.72 89.92,24.19 88.01,24.19 C5.1 87.82,24 86.49,22.67 81.34,22.67
N$9
  Bottom 0.457: C3.2 69.91,54.29 72.2,56.58 72.2,63.06 71.44,63.82 69.72,63.82 67.44,61.53 L6203.9
N$10  (via drill 0.35)
  Top 0.457: D4.A 94.87,20.19 v88.58,26.48 79.06,26.48 73.15,32.38 47.24,32.38 40.2,39.43 25.72,39.43 v22.86,42.29 | v19.62,47.24 12.76,47.24 v11.62,46.1
  Bottom 0.457: SJ5.2 92.2,24.19 92.2,22.86 94.87,20.19 D4.A | 83.92,25.43 85.15,24.19 C5.2 | 83.92,25.43 83.63,25.72 81.53,25.72 R3.1 81.34,25.91 81.34,30.48 78.49,33.34 78.11,33.34 IC2.1 | 83.92,25.43 86.49,28 SJ4.2 86.3,27.62 87.44,26.48 v88.58,26.48 | C10.2 16.38,32.19 16.38,34.1 13.72,36.77 13.53,36.77 9.53,40.77 9.53,41.15 7.62,43.05 ESP32.IO36 8.19,42.67 v11.62,46.1 | M_COURANT.2 24,52.01 24,51.63 v19.62,47.24 19.62,47.05 22.86,43.81 v22.86,42.29
N$11  (via drill 0.35)
  Top 1.372: 85.53,52.96 v85.53,40.58 | 85.53,52.96 90.11,57.53 JP5.1 | L6203.10 69.15,66.48 71.44,64.2 71.63,64.2 74.3,61.53 74.3,60.77 81.72,53.34 84.96,53.34 85.53,52.96
  Bottom 1.372: v85.53,40.58 84.77,39.81 83.82,39.81 R5.1 | JP5.1 90.11,57.53 89.92,57.34 89.92,54.86 R14.2 89.34,54.86 85.34,54.86 R13.2
N$12  (via drill 0.35)
  Top 0.457: v35.81,41.91 38.86,41.91 47.62,33.15 84.39,33.15 96.97,20.57 96.97,17.14 95.06,15.24 RX/TX.3
  Bottom 0.457: v35.81,41.91 31.81,41.91 31.62,42.1 28.77,42.1 SJ3.2
N$13  (via drill 0.35)
  Top 0.457: v63.82,34.1 62.87,34.1 54.67,42.29 54.48,42.29 42.48,54.29 28.19,54.29 27.43,55.05 v14.67,55.05
  Bottom 0.457: R8.2 64.39,28.77 64.39,32 R7.1 64.39,32.19 64.39,33.53 v63.82,34.1 | 13.53,54.1 13.53,49.53 C11.2 | 13.53,54.1 11.62,56.01 9.53,56.01 9.14,55.63 9.14,46.67 9.53,46.29 9.53,45.15 8.76,44.39 6.02,44.39 5.1,43.47 5.1,39.85 6.85,38.1 ESP32.IO34 | v14.67,55.05 13.72,54.1 13.53,54.1
N$14  (via drill 0.35)
  Top 0.457: U$4.OUT+.1 52.58,37.91 52.58,40.2 U$4.OUT+.2 52.39,40.39 47.43,40.39 | 47.43,40.39 47.43,41.53 U$1.OUT+.2 | 47.43,40.39 47.43,39.05 U$1.OUT+.1 | ESP32.5V 7.62,10.1 3.24,10.1 2.67,9.53 JP1.2 | TEST_5V.1 39.24,30.29 39.24,32.58 TEST_5V.2 | v21.91,34.1 21.91,28.38 C6.+ 21.91,28 23.24,26.67 23.24,25.15 v20,21.91
  Bottom 0.457: C4.1 27.24,27.05 23.05,27.05 21.91,28.19 C6.+ | 21.91,34.29 37.53,34.29 39.05,32.77 TEST_5V.2 39.24,32.77 45.34,38.86 47.43,38.86 U$1.OUT+.1 | 21.91,34.29 20.57,34.29 19.05,35.81 19.05,36.2 15.24,40.01 14.48,40.01 U1.3 | v21.91,34.1 21.91,34.29 | ESP32.5V 7.23,10.16 5.71,11.68 5.71,13.41 6.21,13.91 12,13.91 v20,21.91
N$15
  Bottom 0.457: R5.2 81.92,39.81 81.92,40.73 83.6,42.41 C8.2 | R16.1 87.25,37.72 85.15,37.72 84.6,38.27 83.02,38.27 81.69,39.59 R5.2 | IC2.3 78.11,36.01 79.06,36.01 82.11,39.05 R5.2
N$16
  Top 0.457: JP2.2 8,60.2 12.38,60.2 13.91,61.72 15.62,61.72 17.14,60.2 J3.4 17.14,58.86 18.29,57.72 J3.3 | J2.4 31.24,60.01 31.24,58.86 32.38,57.72 J2.3
  Bottom 0.457: 17.91,56.01 17.91,57.15 18.29,57.53 J3.3 | 17.91,56.01 17.91,40.2 19.05,39.05 19.62,39.05 U1.7 | 17.91,56.01 30.48,56.01 32,57.53 32.38,57.53 J2.3
N$17
  Bottom 0.457: ESP32.IO5 29.15,31.81 21.91,31.81 16.19,37.53 14.48,37.53 U1.1
N$18  (via drill 0.35)
  Top 0.457: v18.1,32.58 8,32.58 7.62,32.96 ESP32.IO32 | L6203.11 70.67,61.34 70.67,59.24 v67.25,55.82 60.73,55.82 51.99,47.07 51.95,47.07 v51.63,46.75
  Bottom 0.457: v18.1,32.58 19.05,31.62 19.05,31.24 R10.2 19.24,31.05 27.43,31.05 31.81,26.67 38.29,26.67 50.1,38.48 50.1,45.22 v51.63,46.75 | v67.25,55.82 64.39,55.82 R2.2
N$19
  Bottom 0.457: R11.1 27.43,17.72 27.43,15.05 16.19,3.81 DEFAUT.A
N$20
  Top 0.457: ESP32.IO13 4.57,15.24 2.67,17.14 JP1.5
N$21  (via drill 0.35)
  Top 0.457: v16.57,41.34 29.34,28.57 v29.34,22.1
  Bottom 0.457: v16.57,41.34 14.48,41.34 U1.4 | v29.34,22.1 31.24,22.1 ESP32.IO4
N$22
  Bottom 0.457: R9.1 7.81,54.48 7.81,57.53 JP2.1
N$23
  Top 0.457: ESP32.IO12 7.62,17.91 4.38,17.91 2.67,19.62 JP1.6
N$24  (via drill 0.35)
  Top 0.457: P2.4 39.24,2.29 41.15,2.29 42.67,3.81 UP.3 | ESP32.IO23 34.86,45.72 36.77,43.81 39.81,43.81 48.77,34.86 v48.96,34.86 | v74.87,7.62 72.58,7.62 v70.29,5.33
  Bottom 0.457: v48.96,34.86 48.96,30.29 50.86,28.38 50.86,8.38 | 50.86,8.38 55.24,4 UP.4 55.44,4 56.77,5.33 v70.29,5.33 | v74.87,7.62 78.11,7.62 79.25,6.48 80.96,6.48 85.34,2.1 97.54,2.1 P1.4 | UP.3 42.86,4 46.29,4 50.67,8.38 50.86,8.38
N$25
  Top 0.457: ESP32.IO14 7.62,20.38 4.57,20.38 2.67,22.29 JP1.7
N$26
  Top 0.457: ESP32.IO27 4.57,22.86 2.67,24.77 JP1.8
N$27  (via drill 0.35)
  Top 0.457: P1.2 97.54,7.05 97.16,7.05 94.11,4 SEL.4 93.92,3.81 81.53,3.81 SEL.3 81.34,4 81.34,4.38 75.25,10.48 v46.48,10.48 | ESP32.IO18 32.96,30.48 31.05,28.57 31.05,19.81 31.81,19.05 34.1,19.05 36.96,16.19 36.96,9.34 39.05,7.24 P2.2
  Bottom 0.457: v46.48,10.48 43.24,7.24 39.24,7.24 P2.2
N$28
  Top 0.457: ESP32.IO26 7.62,25.53 4.38,25.53 2.67,27.24 JP1.9
N$29
  Bottom 0.457: R20.1 10.86,35.43 7.62,35.43 ESP32.IO35 7.43,35.43 4.38,32.38 2.67,32.38 JP1.11
N$30
  Top 0.457: JP1.12 2.9,34.89 5.15,37.14 5.15,38.11 7.62,40.58 ESP32.IO39
  Bottom 0.457: R21.1 13.34,34.67 13.34,35.05 7.62,40.77 ESP32.IO39
N$31
  Top 0.457: 1.3-OLED.1 63.06,15.24 63.06,19.43 62.48,20 0.96-OLED.4 62.29,20.19 60.01,20.19 54.67,25.53 41.15,25.53 35.05,31.62 35.05,33.53 ESP32.IO21 32.96,35.62 23.62,35.62 16.95,42.29 9.14,42.29 8.76,41.91 4.38,41.91 2.67,43.62 I2C.4
  Bottom 0.457: R15.2 62.48,22.67 62.48,20.19 0.96-OLED.4
N$32
  Top 0.457: ESP32.IO25 7.62,28 4.57,28 2.67,29.91 JP1.10
N$33  (via drill 0.35)
  Top 0.457: 1.3-OLED.2 65.53,15.24 65.53,19.43 64.96,20 0.96-OLED.3 | I2C.3 2.67,46.29 4.57,44.39 8.76,44.39 9.91,43.24 32.96,43.24 ESP32.IO22 33.15,43.05 38.86,43.05 48.01,33.91 49.34,33.91 49.53,34.1 v50.29,34.1
  Bottom 0.457: R12.2 69.91,22.67 69.34,22.1 69.34,21.91 68.77,21.34 66.1,21.34 64.96,20.19 0.96-OLED.3 | v50.29,34.1 58.1,26.29 58.1,21.34 61.53,17.91 63.06,17.91 64.58,16.38 64.58,16.19 65.53,15.24 1.3-OLED.2
N$34
  Bottom 0.457: L6203.5 60.58,61.53 63.82,64.77 63.82,67.63 65.15,68.96 69.53,68.96 72.96,65.53 72.96,54.86 70.87,52.77 68.58,52.77 67.25,51.44 62.87,51.44 62.48,51.82 62.48,52.01 61.91,52.58 R1.2 61.72,52.58 60.39,52.58 57.34,49.53 57.34,49.34 50.86,42.86 50.86,38.1 36.96,24.19 30.1,24.19 28.77,22.86 20.38,22.86 12.76,30.48 ESP32.IO33
N$35
  Top 0.457: R17.4 94.87,37.53 89.92,37.53 R17.1
  Bottom 0.457: R16.2 87.44,39.43 87.82,39.43 89.72,37.53 R17.1
N$36
  Top 0.457: RX2/TX2.3 41.91,16.57 33.15,25.34 ESP32.IO17
N$37
  Bottom 0.457: R18.1 83.44,20.19 87.25,20.19 D4.C
N$38
  Bottom 0.457: 43.62,54.29 43.62,55.44 43.43,55.63 LED2.K | 43.62,54.29 43.62,51.82 LED1.A | 49.15,55.63 48.39,55.63 LED4.A 48.2,55.44 47.05,54.29 43.62,54.29 | 49.15,55.63 51.05,55.63 R6.1 | 49.15,55.63 49.15,51.63 LED3.C
N$39
  Bottom 0.457: R19.1 92.01,28 88.2,28 SJ4.1
N$41
  Top 0.457: ESP32.IO19 30.29,30.29 30.29,18.1 31.81,16.57 34.1,16.57 36.2,14.48 36.2,7.62 39.05,4.76 P2.3 39.24,4.76 41.53,4.76 42.1,5.33 57.72,5.33 59.05,4 DOWN.3 59.24,4 71.63,4 DOWN.4
  Bottom 0.457: P1.3 97.54,4.76 95.25,4.76 92.77,7.24 79.63,7.24 78.3,8.57 74.49,8.57 71.82,5.91 71.82,4 DOWN.4
N$42
  Top 0.457: 23.05,57.72 27.05,57.72 | 27.05,57.72 29.72,57.72 J2.5 | 23.05,57.72 20.77,60.01 19.81,60.01 J3.2 | J3.5 16,57.53 16.38,57.53 17.91,56.01 21.53,56.01 23.05,57.53 23.05,57.72 | 27.05,57.72 27.05,60.77 28,61.72 32,61.72 33.53,60.2 J2.2
  Bottom 0.457: R9.2 10.67,54.29 10.67,49.72 12.38,48.01 14.67,48.01 15.81,49.15 15.81,57.53 J3.5 | U1.6 19.81,40.2 22.1,40.2 36.58,54.67 36.58,58.1 34.67,60.01 33.72,60.01 J2.2
N$45  (via drill 0.35)
  Top 0.457: v37.15,44.77 45.53,44.77 47.05,43.24 52.39,43.24 v60.77,34.86
  Bottom 0.457: v37.15,44.77 37.15,40.64 34.92,38.42 33.47,38.42 33.15,38.1 ESP32.RXD0 | v60.77,34.86 60.77,28.19 64.77,24.19 70.87,24.19 74.3,20.77 74.3,20.19 76.39,18.1 94.87,18.1 97.73,15.24 RX/TX.4
N$46
  Bottom 0.457: SJ3.1 28.77,40.77 32.96,40.77 ESP32.TXD0
N$48
  Bottom 0.457: R11.2 29.53,17.72 32.96,17.72 ESP32.IO2
N$49
  Bottom 0.457: C9.1 3.81,52.77 7.62,48.96 ESP32.EN
N$52
  Top 0.457: ESP32.IO16 33.15,22.86 39.24,16.76 39.24,15.24 RX2/TX2.4
VS  (1 unrouted)
  Top 1.372: L6203.2 55.44,66.67 56.96,68.2 56.96,68.39 57.91,69.34 81.72,69.34 84.58,66.48 84.58,63.06 81.34,59.82 VIN.3
  Bottom 1.372: R7.2 62.48,32.19 62.48,33.53 62.29,33.72 62.29,34.67 65.34,37.72 68.58,37.72 MP1584.1 69.15,37.91 70.87,37.91 U$4.IN+.1 71.06,38.48 71.06,39.05 | 71.06,39.05 71.06,40.2 U$4.IN+.2 | 71.06,39.05 73.53,39.05 U$1.IN+.1 73.72,39.62 73.72,41.53 U$1.IN+.2 73.72,42.1 73.72,51.63 76.58,54.48 C7.+ 76.96,55.05 76.96,55.44 80.77,59.24 VIN.3 81.34,59.82 84.2,62.67 88.58,62.67

### Text on the board
Top: (c) Locoduino
tNames: (c) Locoduino | LaBox 0.2 | c3
tValues: LaBox 0.2 | P2